# EAGLE design Enclosure 100x68 PDS (EAGLE 9.6.2)
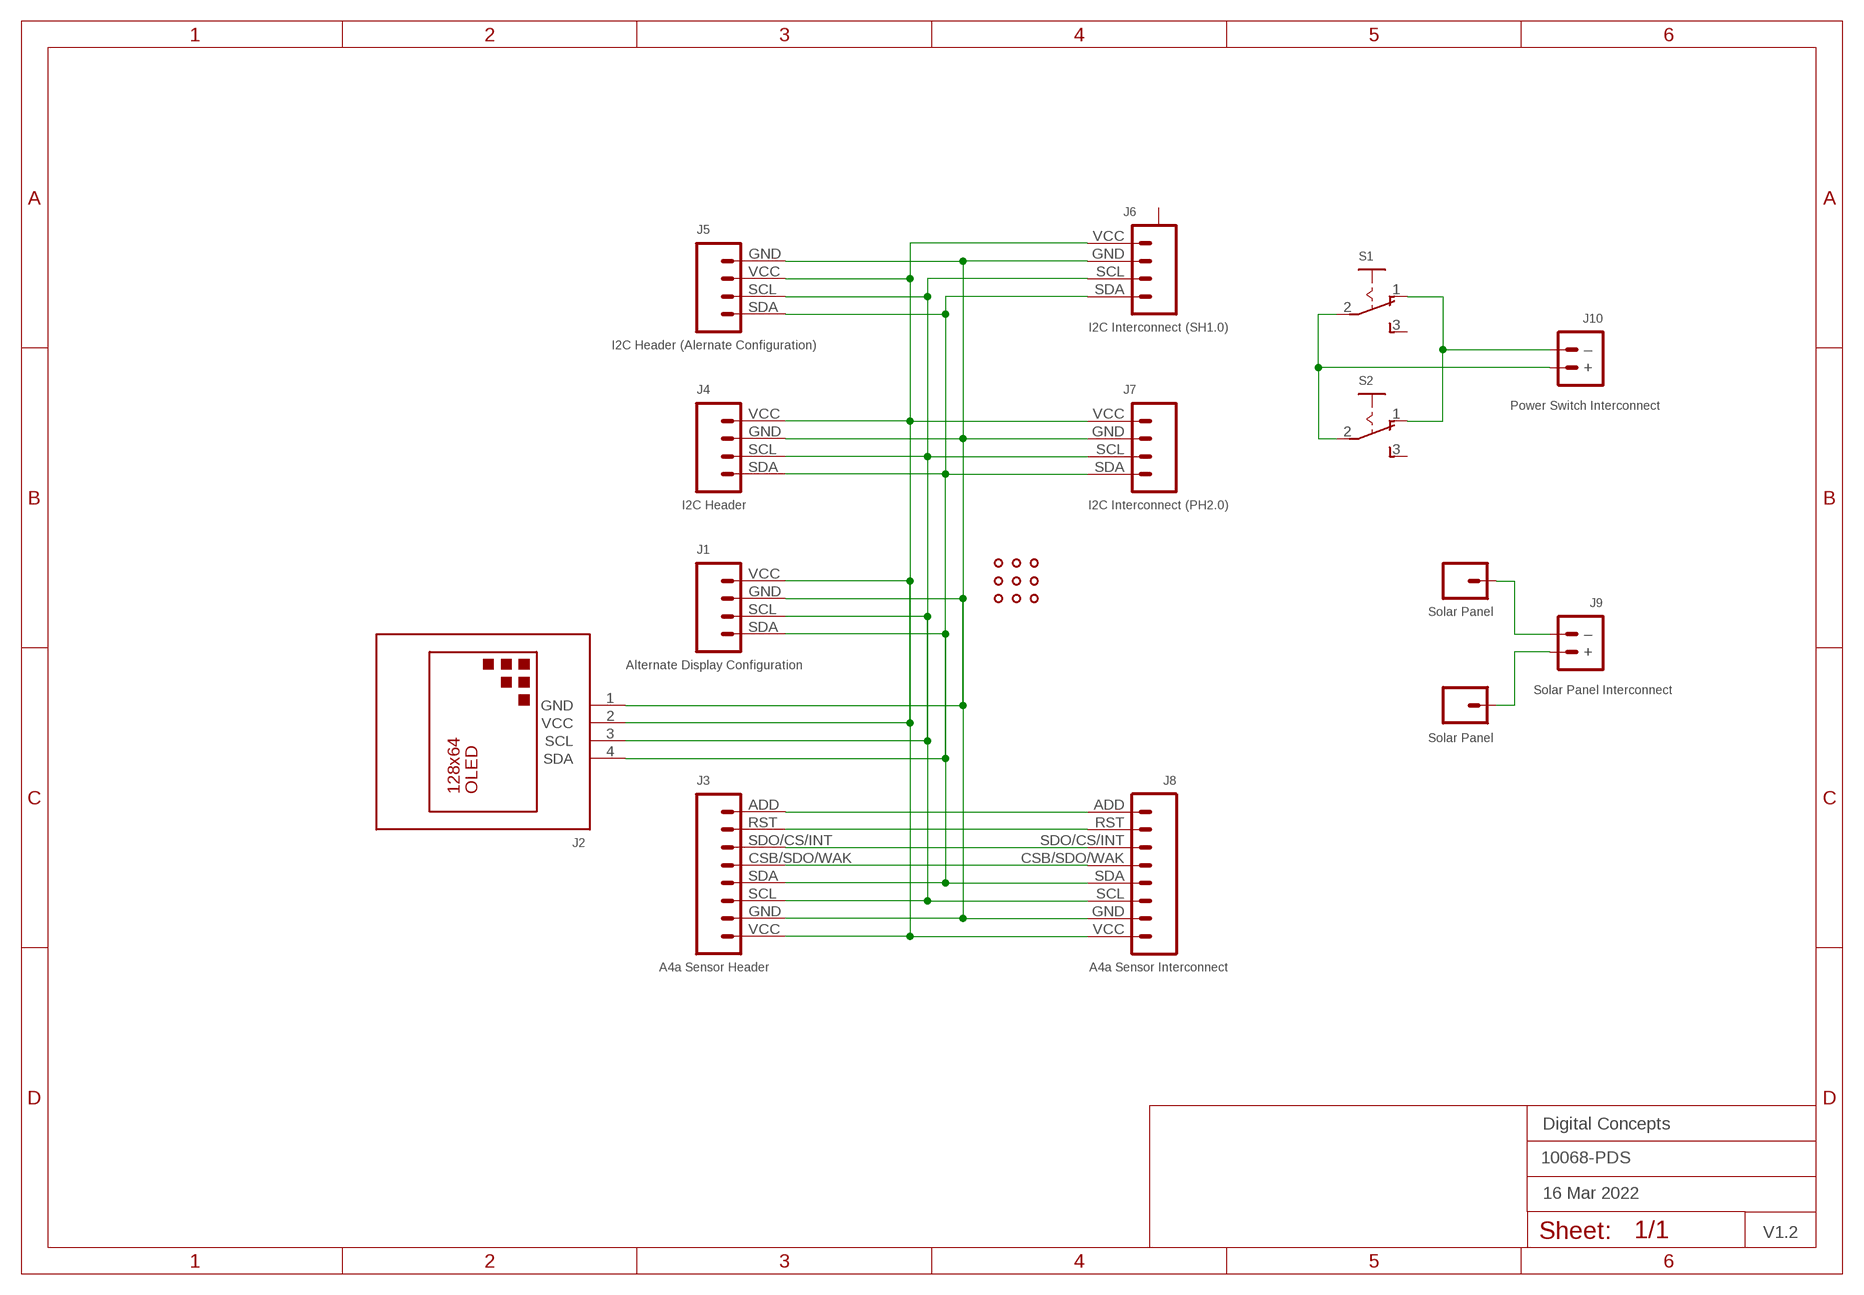
[diagram p0: schematic, sheet 1]
FRAME2 (FRAME-A4L-LOC): DATE: 16 Mar 2022; OWNER: Digital Concepts; TITLE: 10068-PDS; VERSION: V1.2

## Parts
+  Solar Panel  PAD-SMD-GENERIC-SQUARE  [PAD-SMD-GENERIC]
-  Solar Panel  PAD-SMD-GENERIC-SQUARE  [PAD-SMD-GENERIC]
J1  Alternate Display Configuration  HEADER-1X4-I2C  [CONN_04-I2C]
J2  DISPLAY-OLED-128X64-OFFSET-X-I2C  [DISPLAY-OLED-128X64-OFFSET-X-I2C]
J3  A4a Sensor Header  HEADER-1X8-ALF4ALL-SENSOR  [CONN_08-SENSOR]
J4  I2C Header  HEADER-1X4-I2C  [CONN_04-I2C]
J5  I2C Header (Alernate Configuration)  HEADER-1X4-I2C-X  [CONN_04-I2C-X]
J6  I2C Interconnect (SH1.0)  JST-SH1.0-4-I2C-HORIZONTAL  [JST-SH1.0-4-I2C-HORIZONTAL]
J7  I2C Interconnect (PH2.0)  JST-PH2.0-4-I2C-HORIZONTAL  [JST-PH2.0-4-HORIZONTAL]
J8  A4a Sensor Interconnect  HEADER-1X8-ALF4ALL-SENSOR  [CONN_08-SENSOR]
J9  Solar Panel Interconnect  JST-PH2.0-2-HORIZONTALJST-PTH-2  [JST-PH2.0-2-HORIZONTAL]
J10  Power Switch Interconnect  JST-PH2.0-2-HORIZONTALJST-PTH-2  [JST-PH2.0-2-HORIZONTAL]
S1  SWITCH-SLIDE-SPDT  [SWITCH-SPDT-PTH]
S2  SWITCH-SLIDE-SPDT  [SWITCH-SPDT-PTH]
U$1  PROTO-34X22-JST-DS  [PROTO-34X22-JST-DS]

## Nets
GND: J1.GND J2.1(GND) J3.GND J4.GND J5.GND J6.GND J7.GND J8.GND
N$1: J1.SDA J2.4(SDA) J3.SDA J4.SDA J5.SDA J6.SDA J7.SDA J8.SDA
N$2: J1.SCL J2.3(SCL) J3.SCL J4.SCL J5.SCL J6.SCL J7.SCL J8.SCL
N$3: J3.CSB/SDO/WAK J8.CSB/SDO/WAK
N$4: J3.SDO/CS/INT J8.SDO/CS/INT
N$5: J3.RST J8.RST
N$6: J3.ADD J8.ADD
N$7: -.P$1 J9.2(–)
N$8: +.P$1 J9.1(+)
N$10: J10.1(+) S1.2(P) S2.2(P)
N$11: J10.2(–) S1.1(O) S2.1(O)
VCC: J1.VCC J2.2(VCC) J3.VCC J4.VCC J5.VCC J6.VCC J7.VCC J8.VCC
Unconnected: J6.A@1(A) J6.A@4(A) S1.3(S) S2.3(S)

## Library data of the parts
+ - = digitalconcepts:PAD-SMD-GENERIC-SQUARE: SMD Pad—Square
J1 J4 = digitalconcepts:HEADER-1X4-I2C: I2C Interface [Pin 1 Vcc] 4-Pin Header
J2 = digitalconcepts:DISPLAY-OLED-128X64-OFFSET-X-I2C: 128x64 Dot Matrix OLED Module based on SSD1306 chip Offset header variant with I2C interface More details available here: http://www.instructables.com/id/Monochrome-096-i2c-OLED-display-with-arduino-SSD13/ SSD1306 datasheet: https://cdn-shop.adafruit.com/datasheets/SSD1306.pdf Click here to find device on ebay.com <http://www.ebay.com/sch/oled+display+128x64+iic> Note: There are two variants: I2C and SPI. Search for the proper version.
J3 J8 = digitalconcepts:HEADER-1X8-ALF4ALL-SENSOR: IoT Sensors 1x8 Pin Header for 'Sandwich' IoT Sensors
J5 = digitalconcepts:HEADER-1X4-I2C-X: I2C Interface [Pin 1 GND] 4-Pin Header
J6 = digitalconcepts:JST-SH1.0-4-I2C-HORIZONTAL: JST SH1.0 SMD 4P I2C horizontal connector
J7 = digitalconcepts:JST-PH2.0-4-I2C-HORIZONTAL: PH2.0 4P I2C Horizontal Connector
J9 J10 = digitalconcepts:JST-PH2.0-2-HORIZONTAL: PH2.0 2P Right Angle PCB Connector; PROD_ID: CONN-09863; SKU: PRT-09914
S1 S2 = digitalconcepts:SWITCH-SLIDE-SPDT: Mini Sliding Switch SPDT
U$1 = digitalconcepts:PROTO-34X22-JST-DS: 34 x 22 Prototyping board with JST connector points and space for OLED Display, various sensor headers and RJ11 sockets to fit an 100 x 68 enclosure

## Board
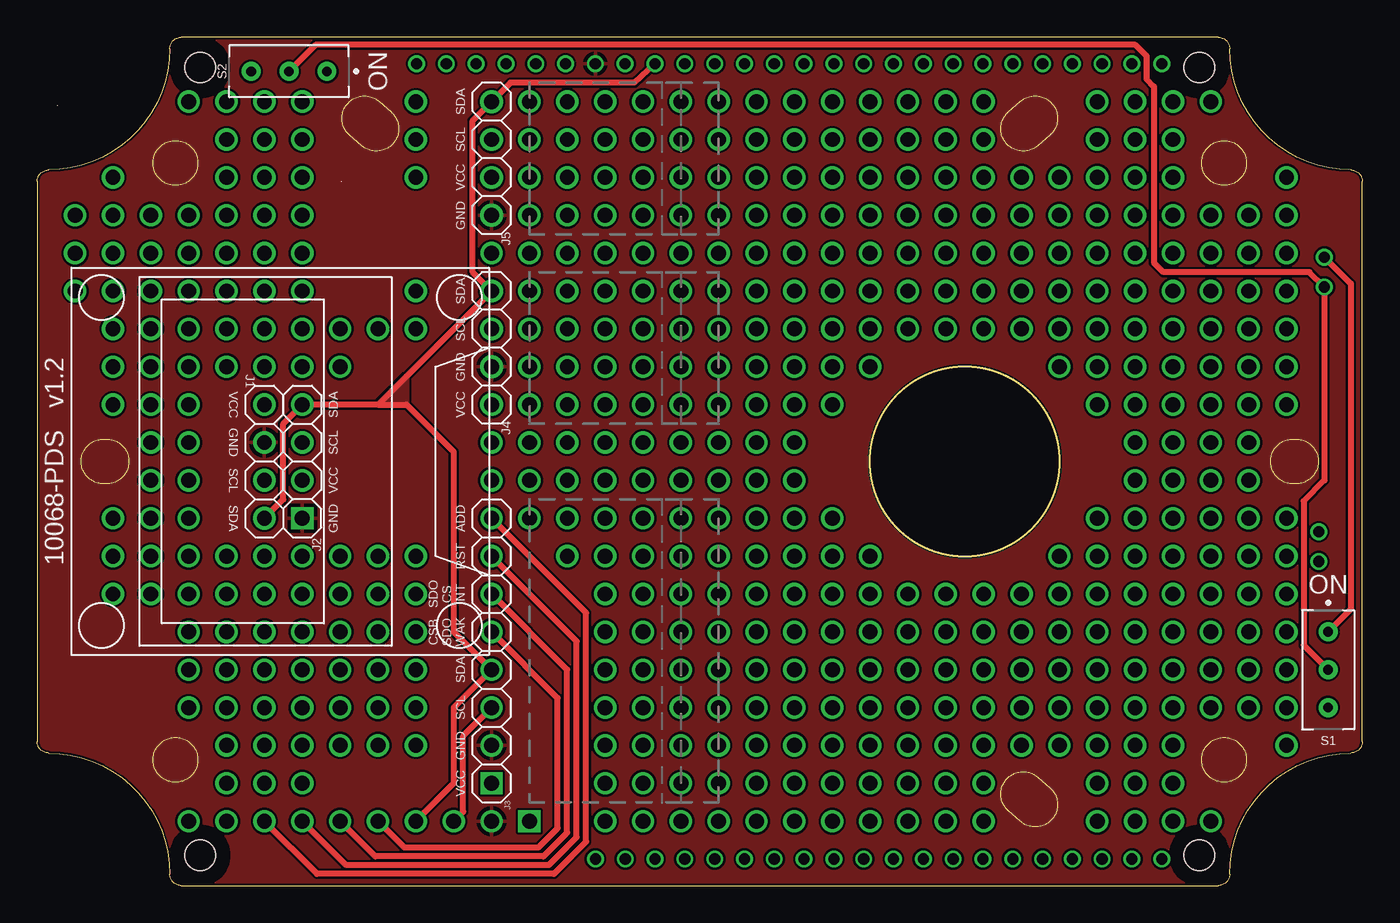
[diagram p1: board, top side]
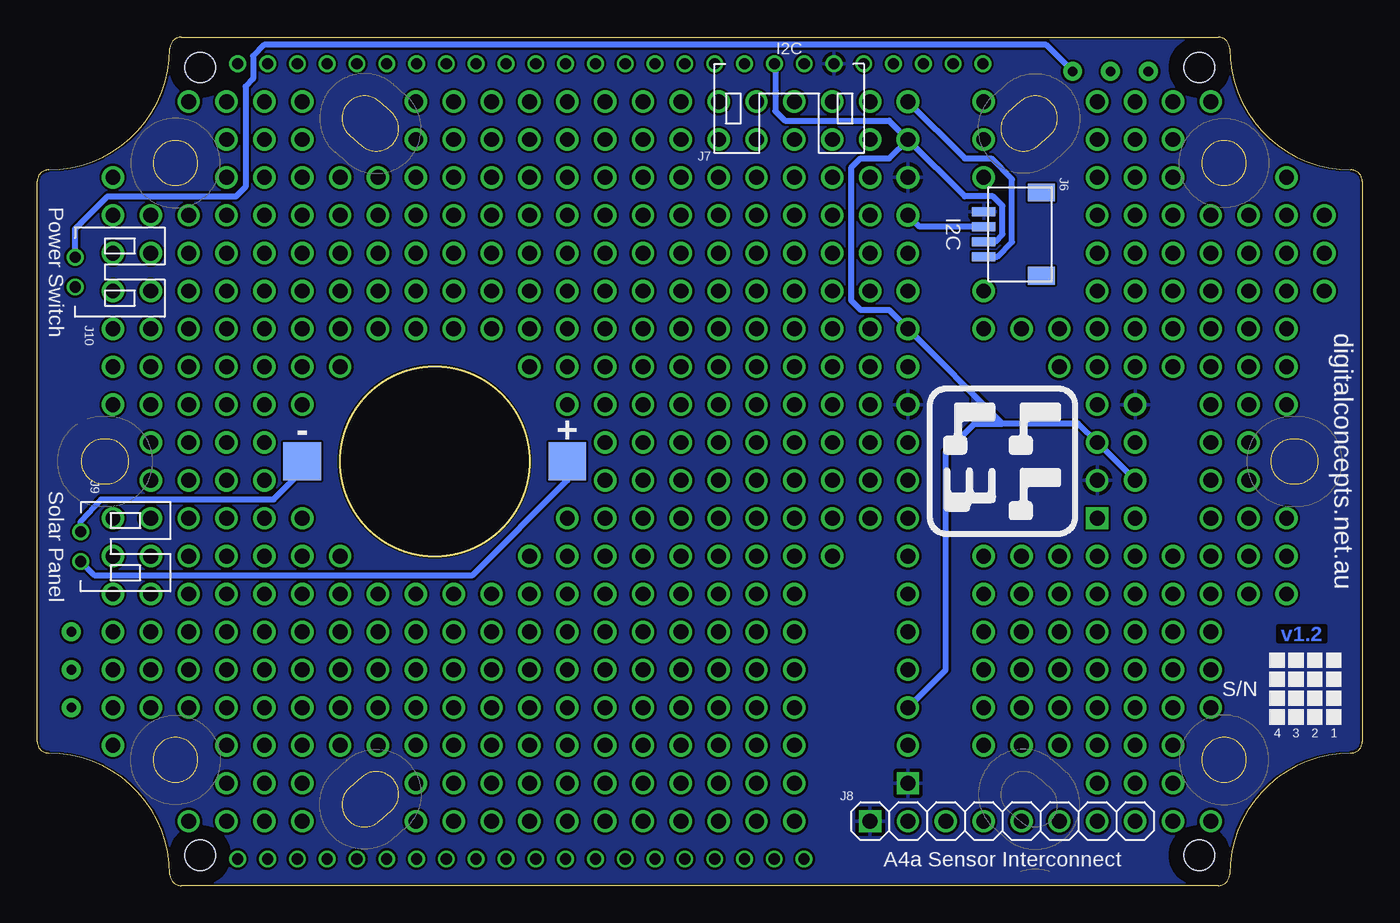
[diagram p2: board, bottom side, seen from below]

Size 88.9 x 56.9 mm. Coordinates in mm from the lower left corner, seen from the top.
Copper layers (1*16): Top 0.035mm / dielectric 1.5mm / Bottom 0.035mm
Design rules "default *": minimum track width 6mil, minimum drill 0.35mm, track to track 6mil, track to pad 6mil, pad to pad 6mil, via to via 6mil, smd to smd 6mil, copper to edge 6mil, drill to drill 6mil, minimum pad ring 1mil, minimum via ring 8mil, stop-mask expansion 4mil, vias tented up to drill 0mil, thermal gap 10mil

### Footprints (pad centres in the part's own frame; a part is rotated, then mirrored left to right if it is on the bottom)
PAD-SMD-GENERIC = smd 2.54 x 2.54: P$1 0,0
CONN_04-I2C = drill 1 pad 1.524: GND 5.08,0; SCL 2.54,0; SDA 0,0; VCC 7.62,0
DISPLAY-OLED-128X64-OFFSET-X-I2C = drill 1 square: 1 -3.81,0 | drill 1: 2 -1.27,0; 3 1.27,0; 4 3.81,0
CONN_08-SENSOR = drill 1: ADD 17.78,0; CSB/SDO/WAK 10.16,0; GND 2.54,0; RST 15.24,0; SCL 5.08,0; SDA 7.62,0; SDO/CS/INT 12.7,0 | drill 1 square: VCC 0,0
CONN_04-I2C-X = drill 1 pad 1.524: GND 7.62,0; SCL 2.54,0; SDA 0,0; VCC 5.08,0
JST-SH1.0-4-I2C-HORIZONTAL = smd 1.2 x 1.8: A@1 -2.8,-3.875; A@4 2.8,-3.875 | smd 0.6 x 1.55: GND 0.5,0; SCL -0.5,0; SDA -1.5,0; VCC 1.5,0
JST-PH2.0-4-HORIZONTAL = drill 0.75: GND -1,0; SCL 1,0; SDA 3,0; VCC -3,0
JST-PH2.0-2-HORIZONTAL = drill 0.75: 1 1,0; 2 -1,0
SWITCH-SPDT-PTH = drill 0.65 pad 1.27: 1 -2.54,0; 2 0,0; 3 2.54,0
PROTO-34X22-JST-DS = drill 1: P01-16 -41.91,11.43; P01-17 -41.91,13.97; P01-18 -41.91,16.51; P02-08 -39.37,-8.89; P02-09 -39.37,-6.35; P02-10 -39.37,-3.81; P02-13 -39.37,3.81; P02-14 -39.37,6.35; P02-15 -39.37,8.89; P02-16 -39.37,11.43; P02-17 -39.37,13.97; P02-18 -39.37,16.51; P02-19 -39.37,19.05; P03-08 -36.83,-8.89; P03-09 -36.83,-6.35; P03-10 -36.83,-3.81; P03-11 -36.83,-1.27; P03-12 -36.83,1.27; P03-13 -36.83,3.81; P03-14 -36.83,6.35; P03-15 -36.83,8.89; P03-16 -36.83,11.43; P03-17 -36.83,13.97; P03-18 -36.83,16.51; P04-02 -34.29,-24.13; P04-05 -34.29,-16.51; P04-06 -34.29,-13.97; P04-07 -34.29,-11.43; P04-08 -34.29,-8.89; P04-09 -34.29,-6.35; P04-10 -34.29,-3.81; P04-11 -34.29,-1.27; P04-12 -34.29,1.27; P04-13 -34.29,3.81; P04-14 -34.29,6.35; P04-15 -34.29,8.89; P04-16 -34.29,11.43; P04-17 -34.29,13.97; P04-18 -34.29,16.51; P04-21 -34.29,24.13; P05-02 -31.75,-24.13; P05-03 -31.75,-21.59; P05-04 -31.75,-19.05; P05-05 -31.75,-16.51; P05-06 -31.75,-13.97; P05-07 -31.75,-11.43; P05-08 -31.75,-8.89; P05-09 -31.75,-6.35; P05-14 -31.75,6.35; P05-15 -31.75,8.89; P05-16 -31.75,11.43; P05-17 -31.75,13.97; P05-18 -31.75,16.51; P05-19 -31.75,19.05; P05-20 -31.75,21.59; P05-21 -31.75,24.13; P06-03 -29.21,-21.59; P06-04 -29.21,-19.05; P06-05 -29.21,-16.51; P06-06 -29.21,-13.97; P06-07 -29.21,-11.43; P06-08 -29.21,-8.89; P06-09 -29.21,-6.35; P06-14 -29.21,6.35; P06-15 -29.21,8.89; P06-16 -29.21,11.43; P06-17 -29.21,13.97; P06-18 -29.21,16.51; P06-19 -29.21,19.05; P06-20 -29.21,21.59; P06-21 -29.21,24.13; P07-03 -26.67,-21.59; P07-04 -26.67,-19.05; P07-05 -26.67,-16.51; P07-06 -26.67,-13.97; P07-07 -26.67,-11.43; P07-08 -26.67,-8.89; P07-09 -26.67,-6.35; P07-14 -26.67,6.35; P07-15 -26.67,8.89; P07-16 -26.67,11.43; P07-17 -26.67,13.97; P07-18 -26.67,16.51; P07-19 -26.67,19.05; P07-20 -26.67,21.59; P07-21 -26.67,24.13; P08-04 -24.13,-19.05; P08-05 -24.13,-16.51; P08-06 -24.13,-13.97; P08-07 -24.13,-11.43; P08-08 -24.13,-8.89; P08-09 -24.13,-6.35; P08-14 -24.13,6.35; P08-15 -24.13,8.89; P09-04 -21.59,-19.05; P09-05 -21.59,-16.51; P09-06 -21.59,-13.97; P09-07 -21.59,-11.43; P09-08 -21.59,-8.89; P09-09 -21.59,-6.35; P09-15 -21.59,8.89; P10-04 -19.05,-19.05; P10-05 -19.05,-16.51; P10-06 -19.05,-13.97; P10-07 -19.05,-11.43; P10-08 -19.05,-8.89; P10-09 -19.05,-6.35; P10-15 -19.05,8.89; P10-16 -19.05,11.43; P10-19 -19.05,19.05; P10-20 -19.05,21.59; P10-21 -19.05,24.13; P12-11 -13.97,-1.27; P12-12 -13.97,1.27; P12-17 -13.97,13.97; P13-10 -11.43,-3.81; P13-11 -11.43,-1.27; P13-12 -11.43,1.27; P13-13 -11.43,3.81; P13-14 -11.43,6.35; P13-15 -11.43,8.89; P13-16 -11.43,11.43; P13-17 -11.43,13.97; P13-18 -11.43,16.51; P13-19 -11.43,19.05; P13-20 -11.43,21.59; P13-21 -11.43,24.13; P14-09 -8.89,-6.35; P14-10 -8.89,-3.81; P14-11 -8.89,-1.27; P14-12 -8.89,1.27; P14-13 -8.89,3.81; P14-14 -8.89,6.35; P14-15 -8.89,8.89; P14-16 -8.89,11.43; P14-17 -8.89,13.97; P14-18 -8.89,16.51; P14-19 -8.89,19.05; P14-20 -8.89,21.59; P14-21 -8.89,24.13; P15-02 -6.35,-24.13; P15-03 -6.35,-21.59; P15-04 -6.35,-19.05; P15-05 -6.35,-16.51; P15-06 -6.35,-13.97; P15-07 -6.35,-11.43; P15-08 -6.35,-8.89; P15-09 -6.35,-6.35; P15-10 -6.35,-3.81; P15-11 -6.35,-1.27; P15-12 -6.35,1.27; P15-13 -6.35,3.81; P15-14 -6.35,6.35; P15-15 -6.35,8.89; P15-16 -6.35,11.43; P15-17 -6.35,13.97; P15-18 -6.35,16.51; P15-19 -6.35,19.05; P15-20 -6.35,21.59; P15-21 -6.35,24.13; P16-02 -3.81,-24.13; P16-03 -3.81,-21.59; P16-04 -3.81,-19.05; P16-05 -3.81,-16.51; P16-06 -3.81,-13.97; P16-07 -3.81,-11.43; P16-08 -3.81,-8.89; P16-09 -3.81,-6.35; P16-10 -3.81,-3.81; P16-11 -3.81,-1.27; P16-12 -3.81,1.27; P16-13 -3.81,3.81; P16-14 -3.81,6.35; P16-15 -3.81,8.89; P16-16 -3.81,11.43; P16-17 -3.81,13.97; P16-18 -3.81,16.51; P16-19 -3.81,19.05; P16-20 -3.81,21.59; P16-21 -3.81,24.13; P17-02 -1.27,-24.13; P17-03 -1.27,-21.59; P17-04 -1.27,-19.05; P17-05 -1.27,-16.51; P17-06 -1.27,-13.97; P17-07 -1.27,-11.43; P17-08 -1.27,-8.89; P17-09 -1.27,-6.35; P17-10 -1.27,-3.81; P17-11 -1.27,-1.27; P17-12 -1.27,1.27; P17-13 -1.27,3.81; P17-14 -1.27,6.35; P17-15 -1.27,8.89; P17-16 -1.27,11.43; P17-17 -1.27,13.97; P17-18 -1.27,16.51; P17-19 -1.27,19.05; P17-20 -1.27,21.59; P17-21 -1.27,24.13; P18-02 1.27,-24.13; P18-03 1.27,-21.59; P18-04 1.27,-19.05; P18-05 1.27,-16.51; P18-06 1.27,-13.97; P18-07 1.27,-11.43; P18-08 1.27,-8.89; P18-09 1.27,-6.35; P18-10 1.27,-3.81; P18-11 1.27,-1.27; P18-12 1.27,1.27; P18-13 1.27,3.81; P18-14 1.27,6.35; P18-15 1.27,8.89; P18-16 1.27,11.43; P18-17 1.27,13.97; P18-18 1.27,16.51; P18-19 1.27,19.05; P18-20 1.27,21.59; P18-21 1.27,24.13; P19-02 3.81,-24.13; P19-03 3.81,-21.59; P19-04 3.81,-19.05; P19-05 3.81,-16.51; P19-06 3.81,-13.97; P19-07 3.81,-11.43; P19-08 3.81,-8.89; P19-09 3.81,-6.35; P19-10 3.81,-3.81; P19-11 3.81,-1.27; P19-12 3.81,1.27; P19-13 3.81,3.81; P19-14 3.81,6.35; P19-15 3.81,8.89; P19-16 3.81,11.43; P19-17 3.81,13.97; P19-18 3.81,16.51; P19-19 3.81,19.05; P19-20 3.81,21.59; P19-21 3.81,24.13; P20-02 6.35,-24.13; P20-03 6.35,-21.59; P20-04 6.35,-19.05; P20-05 6.35,-16.51; P20-06 6.35,-13.97; P20-07 6.35,-11.43; P20-08 6.35,-8.89; P20-09 6.35,-6.35; P20-10 6.35,-3.81; P20-11 6.35,-1.27; P20-12 6.35,1.27; P20-13 6.35,3.81; P20-14 6.35,6.35; P20-15 6.35,8.89; P20-16 6.35,11.43; P20-17 6.35,13.97; P20-18 6.35,16.51; P20-19 6.35,19.05; P20-20 6.35,21.59; P20-21 6.35,24.13; P21-02 8.89,-24.13; P21-03 8.89,-21.59; P21-04 8.89,-19.05; P21-05 8.89,-16.51; P21-06 8.89,-13.97; P21-07 8.89,-11.43; P21-08 8.89,-8.89; P21-09 8.89,-6.35; P21-10 8.89,-3.81; P21-13 8.89,3.81; P21-14 8.89,6.35; P21-15 8.89,8.89; P21-16 8.89,11.43; P21-17 8.89,13.97; P21-18 8.89,16.51; P21-19 8.89,19.05; P21-20 8.89,21.59; P21-21 8.89,24.13; P22-02 11.43,-24.13; P22-03 11.43,-21.59; P22-04 11.43,-19.05; P22-05 11.43,-16.51; P22-06 11.43,-13.97; P22-07 11.43,-11.43; P22-08 11.43,-8.89; P22-09 11.43,-6.35; P22-14 11.43,6.35; P22-15 11.43,8.89; P22-16 11.43,11.43; P22-17 11.43,13.97; P22-18 11.43,16.51; P22-19 11.43,19.05; P22-20 11.43,21.59; P22-21 11.43,24.13; P23-02 13.97,-24.13; P23-03 13.97,-21.59; P23-04 13.97,-19.05; P23-05 13.97,-16.51; P23-06 13.97,-13.97; P23-07 13.97,-11.43; P23-08 13.97,-8.89; P23-15 13.97,8.89; P23-16 13.97,11.43; P23-17 13.97,13.97; P23-18 13.97,16.51; P23-19 13.97,19.05; P23-20 13.97,21.59; P23-21 13.97,24.13; P24-02 16.51,-24.13; P24-03 16.51,-21.59; P24-04 16.51,-19.05; P24-05 16.51,-16.51; P24-06 16.51,-13.97; P24-07 16.51,-11.43; P24-08 16.51,-8.89; P24-15 16.51,8.89; P24-16 16.51,11.43; P24-17 16.51,13.97; P24-18 16.51,16.51; P24-19 16.51,19.05; P24-20 16.51,21.59; P24-21 16.51,24.13; P25-02 19.05,-24.13; P25-03 19.05,-21.59; P25-04 19.05,-19.05; P25-05 19.05,-16.51; P25-06 19.05,-13.97; P25-07 19.05,-11.43; P25-08 19.05,-8.89; P25-15 19.05,8.89; P25-16 19.05,11.43; P25-17 19.05,13.97; P25-18 19.05,16.51; P25-19 19.05,19.05; P25-20 19.05,21.59; P25-21 19.05,24.13; P26-04 21.59,-19.05; P26-05 21.59,-16.51; P26-06 21.59,-13.97; P26-07 21.59,-11.43; P26-08 21.59,-8.89; P26-15 21.59,8.89; P26-16 21.59,11.43; P26-17 21.59,13.97; P26-18 21.59,16.51; P26-19 21.59,19.05; P27-04 24.13,-19.05; P27-05 24.13,-16.51; P27-06 24.13,-13.97; P27-07 24.13,-11.43; P27-08 24.13,-8.89; P27-09 24.13,-6.35; P27-14 24.13,6.35; P27-15 24.13,8.89; P27-16 24.13,11.43; P27-17 24.13,13.97; P27-18 24.13,16.51; P27-19 24.13,19.05; P28-02 26.67,-24.13; P28-03 26.67,-21.59; P28-04 26.67,-19.05; P28-05 26.67,-16.51; P28-06 26.67,-13.97; P28-07 26.67,-11.43; P28-08 26.67,-8.89; P28-09 26.67,-6.35; P28-10 26.67,-3.81; P28-13 26.67,3.81; P28-14 26.67,6.35; P28-15 26.67,8.89; P28-16 26.67,11.43; P28-17 26.67,13.97; P28-18 26.67,16.51; P28-19 26.67,19.05; P28-20 26.67,21.59; P28-21 26.67,24.13; P29-02 29.21,-24.13; P29-03 29.21,-21.59; P29-04 29.21,-19.05; P29-05 29.21,-16.51; P29-06 29.21,-13.97; P29-07 29.21,-11.43; P29-08 29.21,-8.89; P29-09 29.21,-6.35; P29-10 29.21,-3.81; P29-11 29.21,-1.27; P29-12 29.21,1.27; P29-13 29.21,3.81; P29-14 29.21,6.35; P29-15 29.21,8.89; P29-16 29.21,11.43; P29-17 29.21,13.97; P29-18 29.21,16.51; P29-19 29.21,19.05; P29-20 29.21,21.59; P29-21 29.21,24.13; P30-02 31.75,-24.13; P30-03 31.75,-21.59; P30-04 31.75,-19.05; P30-05 31.75,-16.51; P30-06 31.75,-13.97; P30-07 31.75,-11.43; P30-08 31.75,-8.89; P30-09 31.75,-6.35; P30-10 31.75,-3.81; P30-11 31.75,-1.27; P30-12 31.75,1.27; P30-13 31.75,3.81; P30-14 31.75,6.35; P30-15 31.75,8.89; P30-16 31.75,11.43; P30-17 31.75,13.97; P30-18 31.75,16.51; P30-19 31.75,19.05; P30-20 31.75,21.59; P30-21 31.75,24.13; P31-02 34.29,-24.13; P31-05 34.29,-16.51; P31-06 34.29,-13.97; P31-07 34.29,-11.43; P31-08 34.29,-8.89; P31-09 34.29,-6.35; P31-10 34.29,-3.81; P31-11 34.29,-1.27; P31-12 34.29,1.27; P31-13 34.29,3.81; P31-14 34.29,6.35; P31-15 34.29,8.89; P31-16 34.29,11.43; P31-17 34.29,13.97; P31-18 34.29,16.51; P31-21 34.29,24.13; P32-05 36.83,-16.51; P32-06 36.83,-13.97; P32-07 36.83,-11.43; P32-08 36.83,-8.89; P32-09 36.83,-6.35; P32-10 36.83,-3.81; P32-11 36.83,-1.27; P32-12 36.83,1.27; P32-13 36.83,3.81; P32-14 36.83,6.35; P32-15 36.83,8.89; P32-16 36.83,11.43; P32-17 36.83,13.97; P32-18 36.83,16.51; P33-04 39.37,-19.05; P33-05 39.37,-16.51; P33-06 39.37,-13.97; P33-07 39.37,-11.43; P33-08 39.37,-8.89; P33-09 39.37,-6.35; P33-10 39.37,-3.81; P33-13 39.37,3.81; P33-14 39.37,6.35; P33-15 39.37,8.89; P33-16 39.37,11.43; P33-17 39.37,13.97; P33-18 39.37,16.51; P33-19 39.37,19.05 | drill 0.75: P12-22 -19,26.67; P13-22 -17,26.67; P14-22 -15,26.67; P15-22 -13,26.67; P16-22 -11,26.67; P18-01 -7,-26.67; P19-01 -5,-26.67; P20-01 -3,-26.67; P21-01 -1,-26.67; P21-22 -1,26.67; P22-01 1,-26.67; P22-22 1,26.67; P23-01 3,-26.67; P23-22 3,26.67; P24-01 5,-26.67; P24-22 5,26.67; P25-01 7,-26.67; P25-22 7,26.67; P26-01 9,-26.67; P26-22 9,26.67; P27-01 11,-26.67; P27-22 11,26.67; P28-01 13,-26.67; P28-22 13,26.67; P29-01 15,-26.67; P29-22 15,26.67; P30-01 17,-26.67; P30-22 17,26.67; P31-01 19,-26.67; P31-22 19,26.67; P32-01 21,-26.67; P32-22 21,26.67; P33-01 23,-26.67; P33-22 23,26.67; P34-01 25,-26.67; P34-22 25,26.67; P35-01 27,-26.67; P35-22 27,26.67; P36-01 29,-26.67; P36-22 29,26.67; P37-01 31,-26.67; P37-22 31,26.67 | hole 2.032: -33.528,26.416; 33.528,26.416; 33.528,-26.416; -33.528,-26.416 | hole 12.7: 17.78,0

### Placement (x,y rotation side)
+  53.34,28.45 0 bottom
-  71.12,28.45 0 bottom
J1  15.24,24.64 90 top
J2  17.78,28.45 90 top
J3  30.48,6.86 90 top
J4  30.48,39.88 270 top
J5  30.48,52.58 270 top
J6  25.4,43.69 90 bottom
J7  38.45,55.12 180 bottom
J8  33.02,4.32 0 bottom
J9  85.98,22.73 270 bottom
J10  86.36,41.15 270 bottom
S1  86.61,14.48 270 top
S2  16.89,54.61 180 top
U$1  44.45,28.45 0 top

### Tracks (layer width: path | path; a pad name or v marks a point on that pad's centre or on a via)
$X0
  cutout Bottom: 10.92,56.9 arc180 10.92,52.83 arc180
$X1
  cutout Bottom: 77.98,56.9 arc180 77.98,52.83 arc180
$X2
  cutout Bottom: 77.98,4.06 arc180 77.98,0 arc180
$X3
  cutout Bottom: 10.92,4.06 arc180 10.92,0 arc180
$X4
  cutout Top: 10.92,56.9 arc180 10.92,52.83 arc180
$X5
  cutout Top: 77.98,56.9 arc180 77.98,52.83 arc180
$X6
  cutout Top: 77.98,4.06 arc180 77.98,0 arc180
$X7
  cutout Top: 10.92,4.06 arc180 10.92,0 arc180
GND
  Bottom 0.406: J6.GND 29.71,44.19 J5.GND
  pour Top (rank 5): -1.27,58.93 90.17,58.93 90.17,-2.03 -1.27,-2.03
N$1
  Top 0.406: J1.SDA 16.51,25.91 16.51,30.99 J2.4 22.86,32.26 | 22.86,32.26 J4.SDA 29.21,41.15 29.21,51.31 J5.SDA 31.75,53.85 40.06,53.85 J7.SDA | 22.86,32.26 24.77,32.26 27.94,29.08 27.94,17.02 J3.SDA 27.94,11.94 27.94,6.86 J8.SDA
  Bottom 0.406: J6.SDA 24.49,42.19 23.5,43.18 23.5,47.37 24.89,48.77 26.67,48.77 J5.SDA
  pour Top: 24.77,32.26 24.77,34.16 22.86,32.26
N$2
  Top 0.406: J8.SCL 28.58,4.95 28.58,10.03 J3.SCL
  Bottom 0.406: J1.SCL J2.3 19.05,30.99 24.13,30.99 | 24.13,30.99 J4.SCL 31.75,38.61 33.66,38.61 34.29,39.24 34.29,48.13 33.66,48.77 31.75,48.77 J5.SCL | J3.SCL 27.94,14.48 27.94,29.08 26.04,30.99 24.13,30.99 | J7.SCL 39.37,54.99 39.37,51.94 38.73,51.31 31.75,51.31 J5.SCL | J6.SCL 24.63,43.19 24.13,43.69 24.13,45.59 24.77,46.23 26.67,46.23 J5.SCL
  pour Bottom: 24.13,30.99 26.04,30.99 26.04,32.89
N$3
  Top 0.406: J3.CSB/SDO/WAK 34.93,12.57 34.93,3.86 33.6,2.54 24.64,2.54 J8.CSB/SDO/WAK
N$4
  Top 0.406: J3.SDO/CS/INT 35.56,14.48 35.56,3.56 33.96,1.96 22.68,1.96 J8.SDO/CS/INT
N$5
  Top 0.406: J3.RST 36.2,16.38 36.2,3.25 34.32,1.37 20.73,1.37 J8.RST
N$6
  Top 0.406: J3.ADD 36.83,18.29 36.83,2.95 34.67,0.79 18.77,0.79 J8.ADD
N$7
  Bottom 0.406: J9.2 85.98,24.43 84.62,25.91 73.03,25.91 71.12,27.81 -.P$1
N$8
  Bottom 0.406: +.P$1 53.34,27.18 59.69,20.83 85.07,20.83 J9.1
N$10
  Top 0.406: S1.2 84.96,16.13 84.96,25.78 86.36,27.18 J10.1 85.36,41.15 75.56,41.15 74.93,41.78 74.93,53.59 74.42,54.1 74.42,55.64 73.66,56.39 18.67,56.39 S2.2
N$11
  Top 0.406: J10.2 88.14,40.37 88.14,18.54 S1.1
  Bottom 0.406: J10.2 86.36,44.05 84.19,46.23 75.56,46.23 74.93,46.86 74.93,53.59 74.42,54.1 74.42,55.63 73.66,56.39 21.21,56.39 S2.1
VCC
  pour Bottom (rank 5): 0,57.66 88.9,57.66 88.9,-0.76 0,-0.76

### Text on the board
Bottom: v1.2
tPlace: ON | SDA | SCL | VCC | GND | SDA | SCL | GND | VCC | VCC | GND | 10068-PDS v1.2 | SCL | SDA | ADD | RST | SDO / CS / INT | ON | CSB / SDO / WAK | SDA | SCL | GND | VCC
bPlace: digitalconcepts.net.au | S/N | 1 | 2 | 3 | 4
bNames: I2C | I2C | Power Switch | Solar Panel